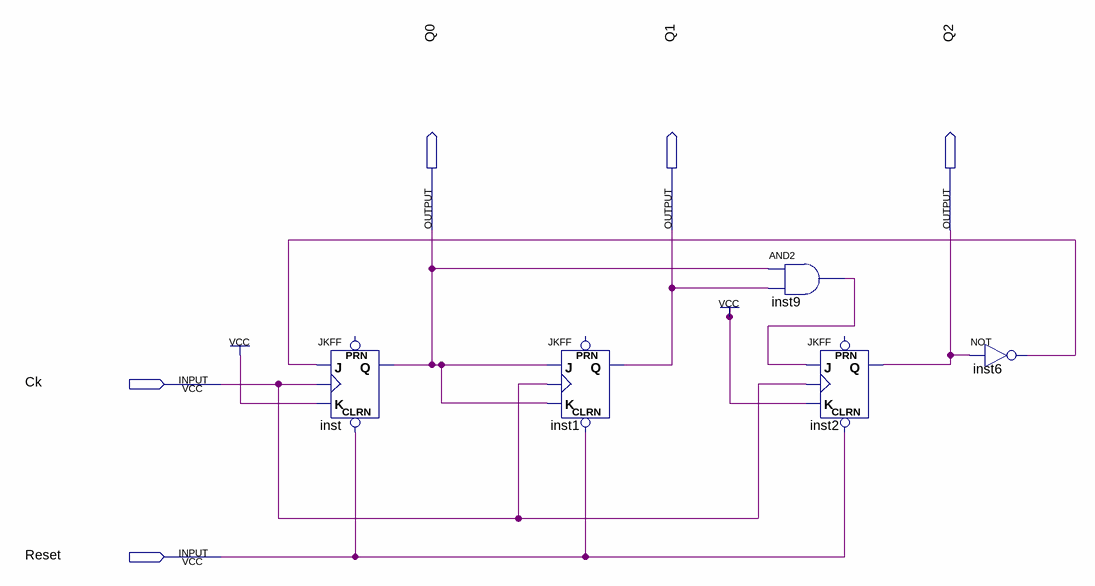
[diagram p0: schematic sheet]
// Quartus schematic Num0_4.bdf as structural Verilog: 5 symbols, 5 pins
module Num0_4 (
  input  Ck,
  input  Reset,
  output Q0,
  output Q1,
  output Q2
);

  wire inst6_out, inst9_out;

  JKFF inst (.CLRN(Reset), .K(1'b1), .J(inst6_out), .CLK(Ck), .Q(Q0));  // open: PRN
  JKFF inst1 (.CLRN(Reset), .K(Q0), .J(Q0), .CLK(Ck), .Q(Q1));  // open: PRN
  and inst9 (inst9_out, Q0, Q1);
  JKFF inst2 (.CLRN(Reset), .K(1'b1), .J(inst9_out), .CLK(Ck), .Q(Q2));  // open: PRN
  not inst6 (inst6_out, Q2);
endmodule
